# EAGLE schematic dfmt (EAGLE 7.3.0)
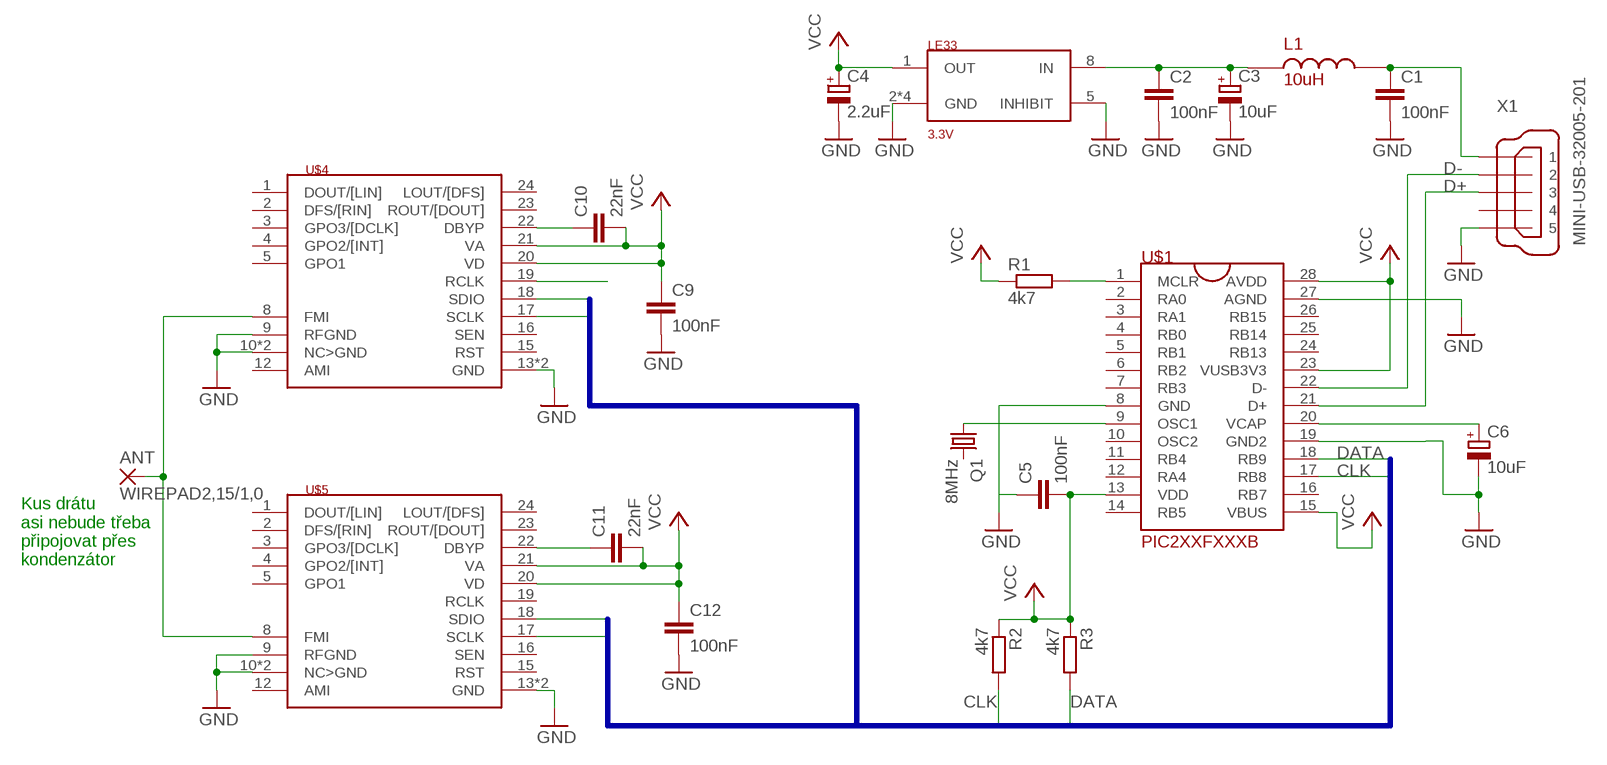
[diagram p0: schematic, sheet 1]

## Parts
ANT  WIREPAD2,15/1,0  [2,15/1,0]
C1  100nF  C-EUC1206  [C1206]
C2  100nF  C-EUC1206  [C1206]
C3  10uF  CPOL-EUSMCB  [SMC_B]
C4  2.2uF  CPOL-EUSMCB  [SMC_B]
C5  100nF  C-EUC1206  [C1206]
C6  10uF  CPOL-EUSMCB  [SMC_B]
C9  100nF  C-EUC1206  [C1206]
C10  22nF  C-EUC1206  [C1206]
C11  22nF  C-EUC1206  [C1206]
C12  100nF  C-EUC1206  [C1206]
L1  10uH  COIL-1210  [R1210]
LE33  3.3V  LE30-SO8  [SO8]
Q1  8MHz  CSM-7X-DU  [CSM-7X-DU]
R1  4k7  R-EU_R1206  [R1206]
R2  4k7  R-EU_R1206  [R1206]
R3  4k7  R-EU_R1206  [R1206]
U$1  PIC2XXFXXXB  [DIL28-3]
U$4  SI4735-D60-GU  [SSOP24]
U$5  SI4735-D60-GU  [SSOP24]
X1  MINI-USB-32005-201  [32005-201]

## Nets
CLK: R2.2 U$1.17(RB8) U$4.17(SCLK) U$5.17(SCLK)
D+: U$1.21(D+) X1.3
D-: U$1.22(D-) X1.2
DATA: R3.2 U$1.18(RB9) U$4.18(SDIO) U$5.18(SDIO)
GND: C1.2 C2.2 C3.- C4.- C5.1 C6.- C9.2 C12.2 LE33.2(GND) LE33.3(GND) LE33.5(INHIBIT) LE33.6(GND) LE33.7(GND) U$1.8(GND) U$1.27(AGND) U$4.9(RFGND) U$4.10(NC>GND) U$4.11(NC>GND) U$4.13(GND) U$4.14(GND) U$5.9(RFGND) U$5.10(NC>GND) U$5.11(NC>GND) U$5.13(GND) U$5.14(GND) X1.5
N$1: C1.1 L1.2 X1.1
N$2: U$4.19(RCLK)
N$3: C2.1 C3.+ L1.1 LE33.8(IN)
N$5: R1.2 U$1.1(MCLR)
N$6: ANT.1(P) U$4.8(FMI) U$5.8(FMI)
N$7: C6.+ U$1.20(VCAP)
N$8: C10.1 U$4.22(DBYP)
N$9: C11.1 U$5.22(DBYP)
N$10: U$1.19(GND2)
N$11: Q1.1 U$1.9(OSC1)
VCC: C4.+ C5.2 C9.1 C10.2 C11.2 C12.1 LE33.1(OUT) R1.1 R2.1 R3.1 U$1.13(VDD) U$1.15(VBUS) U$1.23(VUSB3V3) U$1.28(AVDD) U$4.20(VD) U$4.21(VA) U$5.20(VD) U$5.21(VA)
Unconnected: Q1.2 U$1.2(RA0) U$1.3(RA1) U$1.4(RB0) U$1.5(RB1) U$1.6(RB2) U$1.7(RB3) U$1.10(OSC2) U$1.11(RB4) U$1.12(RA4) U$1.14(RB5) U$1.16(RB7) U$1.24(RB13) U$1.25(RB14) U$1.26(RB15) U$4.1(DOUT/[LIN]) U$4.2(DFS/[RIN]) U$4.3(GPO3/[DCLK]) U$4.4(GPO2/[INT]) U$4.5(GPO1) U$4.12(AMI) U$4.15(RST) U$4.16(SEN) U$4.23(ROUT/[DOUT]) U$4.24(LOUT/[DFS]) U$5.1(DOUT/[LIN]) U$5.2(DFS/[RIN]) U$5.3(GPO3/[DCLK]) U$5.4(GPO2/[INT]) U$5.5(GPO1) U$5.12(AMI) U$5.15(RST) U$5.16(SEN) U$5.19(RCLK) U$5.23(ROUT/[DOUT]) U$5.24(LOUT/[DFS]) X1.4

## Buses
DATA,CLK

## Notes on the sheet
- Kus drátu 
  asi nebude třeba 
  připojovat přes 
  kondenzátor

## Library data of the parts
ANT = wirepad:WIREPAD: Wire PAD connect wire on PCB
C1 C2 C5 C9-C12 = resistor:C-EU: CAPACITOR, European symbol
C3 C4 C6 = resistor:CPOL-EU: POLARIZED CAPACITOR, European symbol
L1 = FMtuner2:COIL
LE33 = FMtuner2:LE30: Very low drop voltage regulator
Q1 = crystal:CSM-7X-DU: SMD CRYSTAL Source: www.ecsxtal.com .. Crystal 3.6864MHz CSM_7X_DU.PDF; OC_FARNELL: unknown; OC_NEWARK: unknown
R1-R3 = resistor:R-EU_: RESISTOR, European symbol
U$1 = dfmt:PIC2XXFXXXB: PIC2xxFxxxb Should be comatible with: PIC32MX210F016B PIC32MX220F032B PIC32MX230F064B PIC32MX250F128B PIC32MX270F256B
U$4 U$5 = dfmt:SI4735-D60: Silicon labs Si4730/31/34/35-D60 AM/FM/SW/LW Radio Receiver
X1 = con-cypressindustries:MINI-USB-: MINI USB-B Conector Source: www.cypressindustries.com; OC_FARNELL: unknown; OC_NEWARK: unknown